# Altium schematic sheet uart_bs.SchDoc
size A4
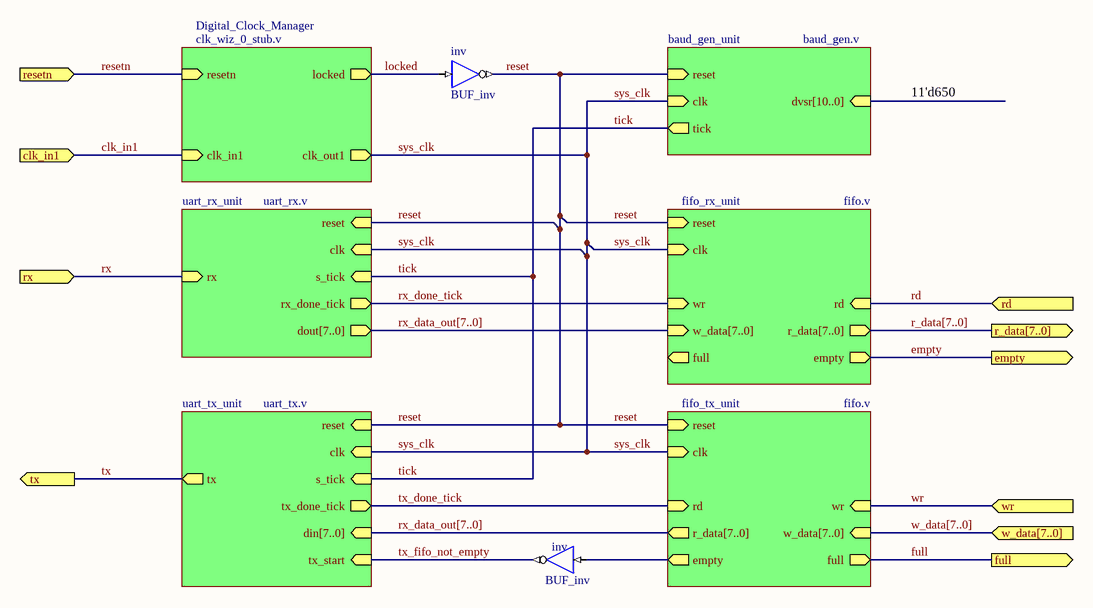
[diagram p0: uart_bs.SchDoc]

## Parts
(Parts that share a designator on the sheet are numbered #1, #2 ... from top to bottom, then left to right.)
inv#1  BUF_inv
inv#2  BUF_inv

## Sub-sheets
baud_gen_unit = baud_gen.v: reset (in), clk (in), tick (out), dvsr[10..0] (in)
Digital_Clock_Manager = clk_wiz_0_stub.v: resetn (in), clk_in1 (in), locked (out), clk_out1 (out)
fifo_rx_unit = fifo.v: reset (in), clk (in), full (out), w_data[7..0] (in), rd (in), wr (in), r_data[7..0] (out), empty (out)
fifo_tx_unit = fifo.v: reset (in), clk (in), full (out), w_data[7..0] (in), rd (in), wr (in), r_data[7..0] (out), empty (out)
uart_rx_unit = uart_rx.v: reset (in), clk (in), rx (in), s_tick (in), rx_done_tick (out), dout[7..0] (out)
uart_tx_unit = uart_tx.v: reset (in), clk (in), tx (out), s_tick (in), tx_done_tick (out), din[7..0] (in), tx_start (in)

## Ports
clk_in1 (in), empty (out), full (out), r_data[7..0] (out), rd (in), resetn (in), rx (in), tx (out), w_data[7..0] (in), wr (in)

## Nets
clk_in1: port clk_in1, sheet Digital_Clock_Manager/clk_in1
empty: port empty, sheet fifo_rx_unit/empty
full: port full, sheet fifo_tx_unit/full
locked: inv#1.I ; sheet Digital_Clock_Manager/locked
rd: port rd, sheet fifo_rx_unit/rd
reset: inv#1.O ; sheet uart_tx_unit/reset, sheet fifo_rx_unit/reset, sheet fifo_tx_unit/reset, sheet baud_gen_unit/reset, sheet uart_rx_unit/reset
resetn: port resetn, sheet Digital_Clock_Manager/resetn
rx: port rx, sheet uart_rx_unit/rx
rx_done_tick: sheet fifo_rx_unit/wr, sheet uart_rx_unit/rx_done_tick
sys_clk: sheet uart_tx_unit/clk, sheet fifo_rx_unit/clk, sheet fifo_tx_unit/clk, sheet Digital_Clock_Manager/clk_out1, sheet baud_gen_unit/clk, sheet uart_rx_unit/clk
tick: sheet uart_tx_unit/s_tick, sheet baud_gen_unit/tick, sheet uart_rx_unit/s_tick
tx: port tx, sheet uart_tx_unit/tx
tx_done_tick: sheet uart_tx_unit/tx_done_tick, sheet fifo_tx_unit/rd
tx_fifo_not_empty: inv#2.O ; sheet uart_tx_unit/tx_start
wr: port wr, sheet fifo_tx_unit/wr
Netinv#2_I: inv#2.I ; sheet fifo_tx_unit/empty

## Buses and harness runs
bus r_data[7..0] = port r_data[7..0] = sheet fifo_rx_unit/r_data[7..0]
bus rx_data_out[7..0] = sheet fifo_rx_unit/w_data[7..0] = sheet uart_rx_unit/dout[7..0]
bus rx_data_out[7..0] = sheet fifo_tx_unit/r_data[7..0] = sheet uart_tx_unit/din[7..0]
bus w_data[7..0] = port w_data[7..0] = sheet fifo_tx_unit/w_data[7..0]

## Notes on the sheet
- 11'd650

## Library data of the parts
inv#1 inv#2 = BUF_inv: 1-bit General Purpose (Non-inverting) Buffer